# Altium schematic sheet PCB_Vigne_Periph.SchDoc
size A4
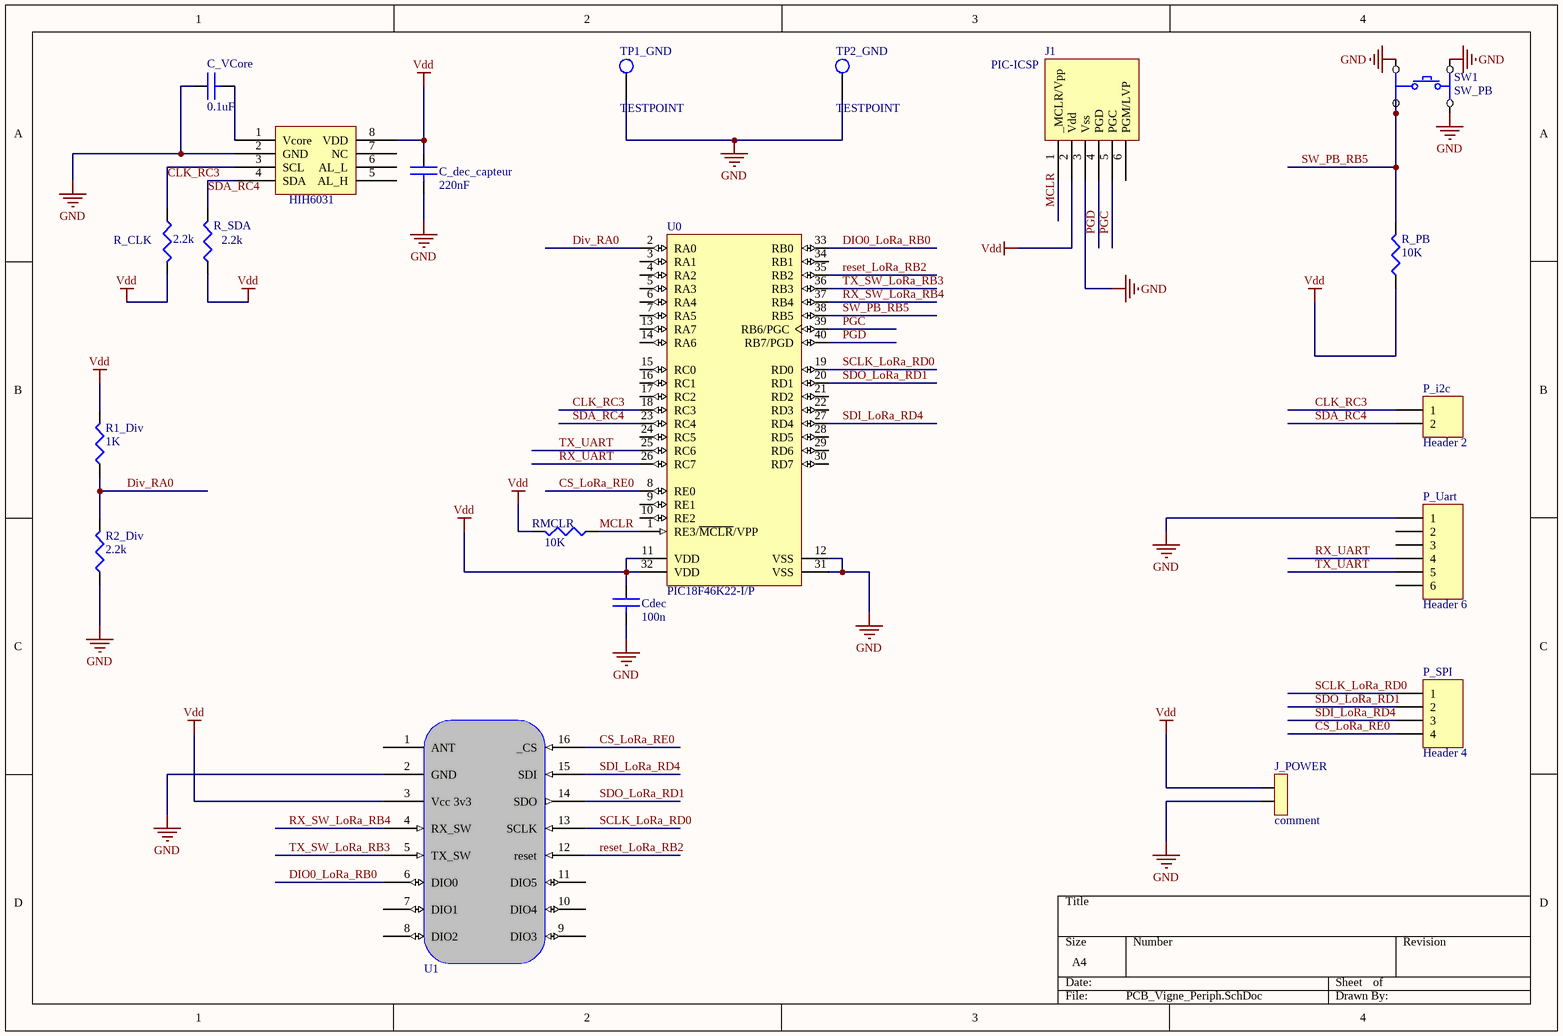
[diagram p0: PCB_Vigne_Periph.SchDoc]

## Parts
C_dec_capteur  value 220nF  [RAD0.2]  (hidden comment: CAP)
C_VCore  value 0.1uF  [RAD0.2]  (hidden comment: CAP)
Cdec  value 100n  [RAD0.2]  (hidden comment: CAP)
HIH6031  HIH6031  [HIH6031-Traversant]  (value not drawn)
J1  PIC-ICSP  [PIC-ICSP]
J_POWER  comment  [AMP_2]
P_i2c  Header 2  [HDR1X2]
P_SPI  Header 4  [HDR1X4]
P_Uart  Header 6  [HDR1X6]
R1_Div  value 1K  [AXIAL0.4]  (hidden comment: RES)
R2_Div  value 2.2k  [AXIAL0.4]  (hidden comment: RES)
R_CLK  value 2.2k  [AXIAL0.4]  (hidden comment: RES)
R_PB  value 10K  [AXIAL0.4]  (hidden comment: RES)
R_SDA  value 2.2k  [AXIAL0.4]  (hidden comment: RES)
RMCLR  value 10K  [AXIAL0.4]  (hidden comment: RES)
SW1  SW_PB  [KSA]
TP1_GND  TESTPOINT  [testpoint]
TP2_GND  TESTPOINT  [testpoint]
U0  PIC18F46K22-I/P  [MCHP-PDIP-P40]
U1  RF-LORA-868-SO  [RF-LORA-868-DIP]  (value not drawn)

## Nets
GND: C_dec_capteur.2 C_VCore.1 Cdec.2 HIH6031.2(GND) J1.3(Vss) J_POWER.1 P_Uart.1 R2_Div.1 SW1.1 SW1.3 SW1.4 TP1_GND.1 TP2_GND.1 U0.12(VSS) U0.31(VSS) U1.2(GND)
Vdd: C_dec_capteur.1 Cdec.1 HIH6031.8(VDD) J1.2(Vdd) J_POWER.2 R1_Div.2 R_CLK.2 R_PB.1 R_SDA.1 RMCLR.2 U0.11(VDD) U0.32(VDD) U1.3(Vcc_3v3)
CLK_RC3: HIH6031.3(SCL) P_i2c.1 R_CLK.1 U0.18(RC3)
CS_LoRa_RE0: P_SPI.4 U0.8(RE0) U1.16(_CS)
DIO0_LoRa_RB0: U0.33(RB0) U1.6(DIO0)
Div_RA0: R1_Div.1 R2_Div.2 U0.2(RA0)
MCLR: J1.1(_MCLR/Vpp) RMCLR.1 U0.1(RE3/~{MCLR}/VPP)
PGC: J1.5(PGC) U0.39(RB6/PGC)
PGD: J1.4(PGD) U0.40(RB7/PGD)
reset_LoRa_RB2: U0.35(RB2) U1.12(reset)
RX_SW_LoRa_RB4: U0.37(RB4) U1.4(RX_SW)
RX_UART: P_Uart.4 U0.26(RC7)
SCLK_LoRa_RD0: P_SPI.1 U0.19(RD0) U1.13(SCLK)
SDA_RC4: HIH6031.4(SDA) P_i2c.2 R_SDA.2 U0.23(RC4)
SDI_LoRa_RD4: P_SPI.3 U0.27(RD4) U1.15(SDI)
SDO_LoRa_RD1: P_SPI.2 U0.20(RD1) U1.14(SDO)
SW_PB_RB5: R_PB.2 SW1.2 U0.38(RB5)
TX_SW_LoRa_RB3: U0.36(RB3) U1.5(TX_SW)
TX_UART: P_Uart.5 U0.25(RC6)
NetC_VCore_2: C_VCore.2 HIH6031.1(Vcore)

Not connected (* = marked no-connect by the designer): HIH6031 5(AL_H) 6(AL_L) 7(NC); J1 6(PGM/LVP); P_Uart 2 3 6; U0 3(RA1) 4(RA2) 5(RA3) 6(RA4) 7(RA5) 9(RE1) 10(RE2) 13(RA7) 14(RA6) 15(RC0) 16(RC1) 17(RC2) 21(RD2) 22(RD3) 24(RC5) 28(RD5) 29(RD6) 30(RD7) 34(RB1); U1 1(ANT) 7(DIO1) 8(DIO2) 9(DIO3) 10(DIO4) 11(DIO5)

## Library data of the parts
C_dec_capteur C_VCore Cdec = CAP: capacité non polarisée
J_POWER = POWER2: connecteur alim 2 pôles
P_i2c = Header 2: Header, 2-Pin; LatestRevisionDate: 17-Jul-2002; LatestRevisionNote: Re-released for DXP Platform.; Publisher: Altium Limited
P_SPI = Header 4: Header, 4-Pin; LatestRevisionDate: 17-Jul-2002; LatestRevisionNote: Re-released for DXP Platform.; Publisher: Altium Limited
P_Uart = Header 6: Header, 6-Pin; LatestRevisionDate: 17-Jul-2002; LatestRevisionNote: Re-released for DXP Platform.; Publisher: Altium Limited
R1_Div R2_Div R_CLK R_PB R_SDA RMCLR = RES: resistance
U0 = PIC18F46K22-I/P: Low-Power, High-Performance Microcontroller with XLP Technology, 64 MHz, 35 I/O, -40 to 85 degC, 40-pin PDIP (P40), Tube; Manufacturer: Microchip; # of A/D Channels: 28; Digital Communication: 2 -A/E/USART, 2 -MSSP(SPI/I2C); EEPROM Data Memory (bytes): 1024; I/O Pins: 35; Internal Oscillator: 16 MHz, 31 kHz; Max. CPU Speed MHz: 64; Memory Type: Flash; Operation Voltage Range: 2.3V - 5.5V; Program Memory KWords: 32; RAM: 3896; Timers: 3 - 8-bit, 4 - 16-bit; DatasheetVersion: Rev. F; PackageVersion: C04-016B, 04/2013; PackageReference: PDIP-P40; PackageDescription: 40-Lead Plastic Dual In-Line Package, Body 51.75 x 13.53 mm, Pitch 2.54 mm; Supplier 1: Digi-Key; Supplier Part Number 1: PIC18F46K22-I/P-ND; Supplier 2: Farnell; Supplier Part Number 2: 1814979; Supplier 3: Newark; Supplier Part Number 3: 65R6012; Supplier 4: Mouser; Supplier Part Number 4: 579-PIC18F46K22IP; Packing: TUBE; Program Memory KBytes: 64; RoHS: TRUE; Mounting Technology: Through Hole; PartNumber: PIC18F46K22-I/P; ComponentLink1Description: Datasheet; ComponentLink1URL: http://ww1.microchip.com/downloads/en/DeviceDoc/41412F.pdf; ComponentLink2Description: Package Specification; ComponentLink2URL: http://www.microchip.com/stellent/groups/techpub_sg/documents/packagingspec/en012702.pdf; ComponentLink3Description: URL Link1; ComponentLink3URL: Product URL:http://www.microchip.com/datasheet/PIC18F46K22